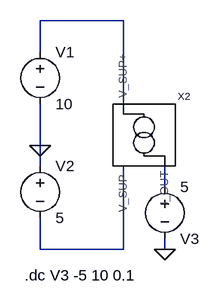
[diagram p0: schematic sim_current_source_highside.asc]
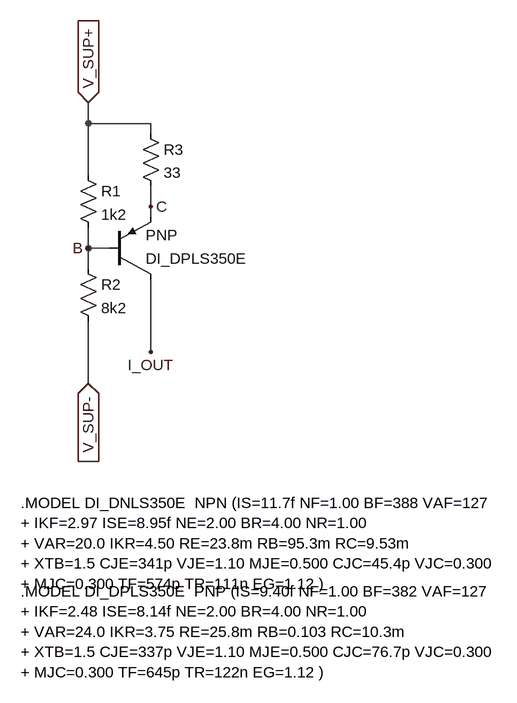
[diagram p1: sub-circuit current_source_highside.asc]
sim_current_source_highside.asc, the LTspice schematic file:
Version 4
SHEET 1 880 680
WIRE 80 0 -48 0
WIRE -48 48 -48 0
WIRE 80 128 80 0
WIRE -48 192 -48 128
WIRE -48 224 -48 192
WIRE 144 256 144 224
WIRE -48 352 -48 304
WIRE 80 352 80 224
WIRE 80 352 -48 352
WIRE 144 352 144 336
FLAG -48 192 0
FLAG 144 352 0
SYMBOL voltage -48 32 R0
WINDOW 123 0 0 Left 0
WINDOW 39 0 0 Left 0
SYMATTR InstName V1
SYMATTR Value 10
SYMBOL voltage -48 208 R0
WINDOW 123 0 0 Left 0
WINDOW 39 0 0 Left 0
SYMATTR InstName V2
SYMATTR Value 5
SYMBOL voltage 144 240 R0
WINDOW 0 24 96 Left 2
WINDOW 3 24 16 Left 2
WINDOW 123 0 0 Left 0
WINDOW 39 0 0 Left 0
SYMATTR InstName V3
SYMATTR Value 5
SYMBOL current_source_highside 112 176 R0
SYMATTR InstName X2
TEXT -72 392 Left 2 !.dc V3 -5 10 0.1

current_source_highside.asc, the sub-circuit schematic file:
Version 4
SHEET 1 912 680
WIRE 240 -400 240 -432
WIRE 336 -400 240 -400
WIRE 336 -384 336 -400
WIRE 240 -320 240 -400
WIRE 336 -272 336 -304
WIRE 336 -256 336 -272
WIRE 240 -208 240 -240
WIRE 272 -208 240 -208
WIRE 240 -176 240 -208
WIRE 336 -48 336 -160
WIRE 240 0 240 -96
FLAG 240 0 V_SUP-
IOPIN 240 0 In
FLAG 240 -432 V_SUP+
IOPIN 240 -432 In
FLAG 336 -48 I_OUT
FLAG 240 -208 B
FLAG 336 -272 C
SYMBOL res 224 -336 R0
SYMATTR InstName R1
SYMATTR Value 1k2
SYMBOL res 224 -192 R0
SYMATTR InstName R2
SYMATTR Value 8k2
SYMBOL res 320 -400 R0
SYMATTR InstName R3
SYMATTR Value 33
SYMBOL pnp 272 -160 M180
SYMATTR InstName DI_DPLS350E
TEXT 136 184 Left 2 !.MODEL DI_DNLS350E  NPN (IS=11.7f NF=1.00 BF=388 VAF=127\n+ IKF=2.97 ISE=8.95f NE=2.00 BR=4.00 NR=1.00\n+ VAR=20.0 IKR=4.50 RE=23.8m RB=95.3m RC=9.53m\n+ XTB=1.5 CJE=341p VJE=1.10 MJE=0.500 CJC=45.4p VJC=0.300\n+ MJC=0.300 TF=574p TR=111n EG=1.12 )
TEXT 136 320 Left 2 !.MODEL DI_DPLS350E  PNP (IS=9.40f NF=1.00 BF=382 VAF=127\n+ IKF=2.48 ISE=8.14f NE=2.00 BR=4.00 NR=1.00\n+ VAR=24.0 IKR=3.75 RE=25.8m RB=0.103 RC=10.3m\n+ XTB=1.5 CJE=337p VJE=1.10 MJE=0.500 CJC=76.7p VJC=0.300\n+ MJC=0.300 TF=645p TR=122n EG=1.12 )

The netlist it stands for:
* sim_current_source_highside.asc
V1 N001 0 10
V2 0 N003 5
V3 N002 0 5
XX2 N001 N003 N002 current_source_highside

* block symbol definitions
.subckt current_source_highside V_SUP+ V_SUP- I_OUT
R1 V_SUP+ B 1k2
R2 B V_SUP- 8k2
R3 V_SUP+ C 33
Q§DI_DPLS350E I_OUT B C 0 PNP
.MODEL DI_DNLS350E  NPN (IS=11.7f NF=1.00 BF=388 VAF=127
+ IKF=2.97 ISE=8.95f NE=2.00 BR=4.00 NR=1.00
+ VAR=20.0 IKR=4.50 RE=23.8m RB=95.3m RC=9.53m
+ XTB=1.5 CJE=341p VJE=1.10 MJE=0.500 CJC=45.4p VJC=0.300
+ MJC=0.300 TF=574p TR=111n EG=1.12 )
.MODEL DI_DPLS350E  PNP (IS=9.40f NF=1.00 BF=382 VAF=127
+ IKF=2.48 ISE=8.14f NE=2.00 BR=4.00 NR=1.00
+ VAR=24.0 IKR=3.75 RE=25.8m RB=0.103 RC=10.3m
+ XTB=1.5 CJE=337p VJE=1.10 MJE=0.500 CJC=76.7p VJC=0.300
+ MJC=0.300 TF=645p TR=122n EG=1.12 )
.ends current_source_highside

.model NPN NPN
.model PNP PNP
.lib standard.bjt
.dc V3 -5 10 0.1
.backanno
.end